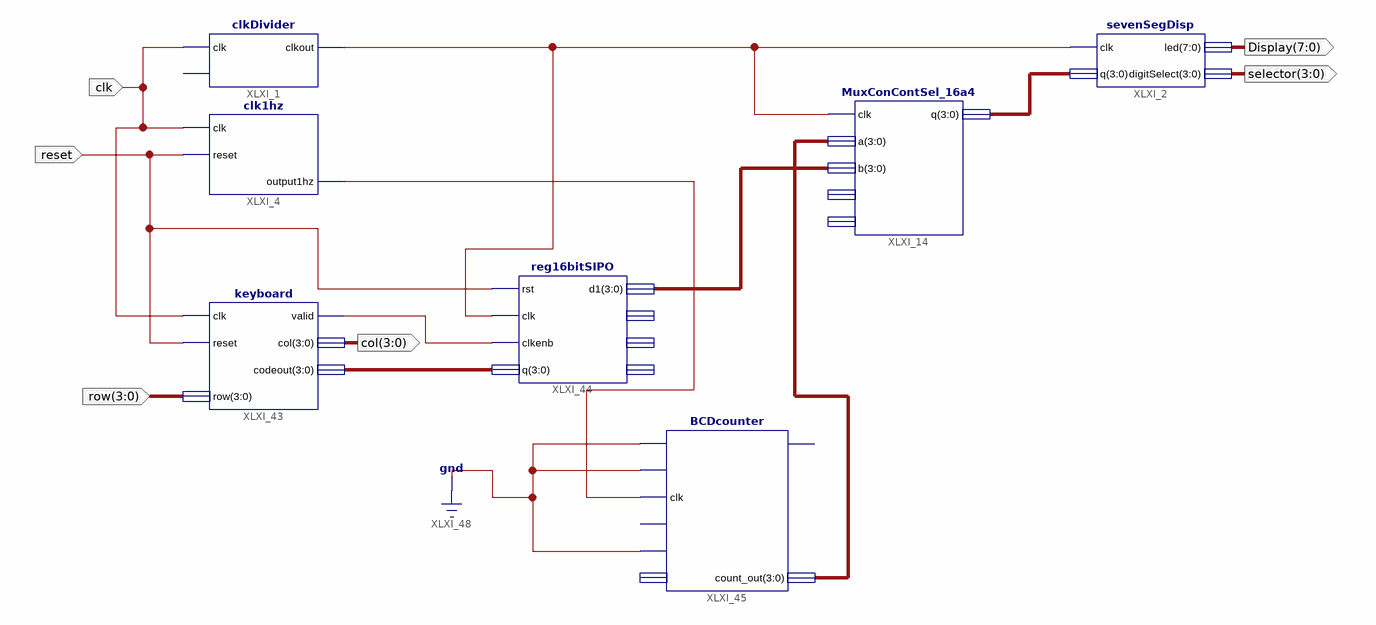
[diagram p0: schematic sheet 1]
// Xilinx ISE schematic top.sch (spartan3e) as structural Verilog: 7 symbols, 6 ports
module top (
  input  clk,
  input  [3:0] row,
  input  reset,
  output [7:0] Display,
  output [3:0] selector,
  output [3:0] col
);

  wire XLXN_163, XLXN_190, XLXN_211;
  wire [3:0] XLXN_87, XLXN_167, XLXN_209, XLXN_215;

  sevenSegDisp XLXI_2 (.clk(XLXN_190), .q(XLXN_87), .led(Display), .digitSelect(selector));
  clkDivider XLXI_1 (.clk(clk), .clkout(XLXN_190));  // open: reset
  clk1hz XLXI_4 (.clk(clk), .reset(reset), .output1hz(XLXN_211));
  MuxConContSel_16a4 XLXI_14 (.clk(XLXN_190), .a(XLXN_209), .b(XLXN_215), .q(XLXN_87));  // open: c, d
  reg16bitSIPO XLXI_44 (
    .rst(reset), .clk(XLXN_190), .clkenb(XLXN_163), .q(XLXN_167), .d1(XLXN_215));  // open: d2, d3, d4
  keyboard XLXI_43 (.clk(clk), .reset(reset), .valid(XLXN_163), .col(col), .codeout(XLXN_167), .row(row));
  BCDcounter XLXI_45 (
    .reset(1'b0), .updw(1'b0), .clk(XLXN_211), .clkenb(1'b0), .count_out(XLXN_209));  // open: loadenb, load_in, carry_out
endmodule
